# Altium schematic sheet DC_Link.SchDoc
size A4; SheetNumber: 8; SheetTotal: 9
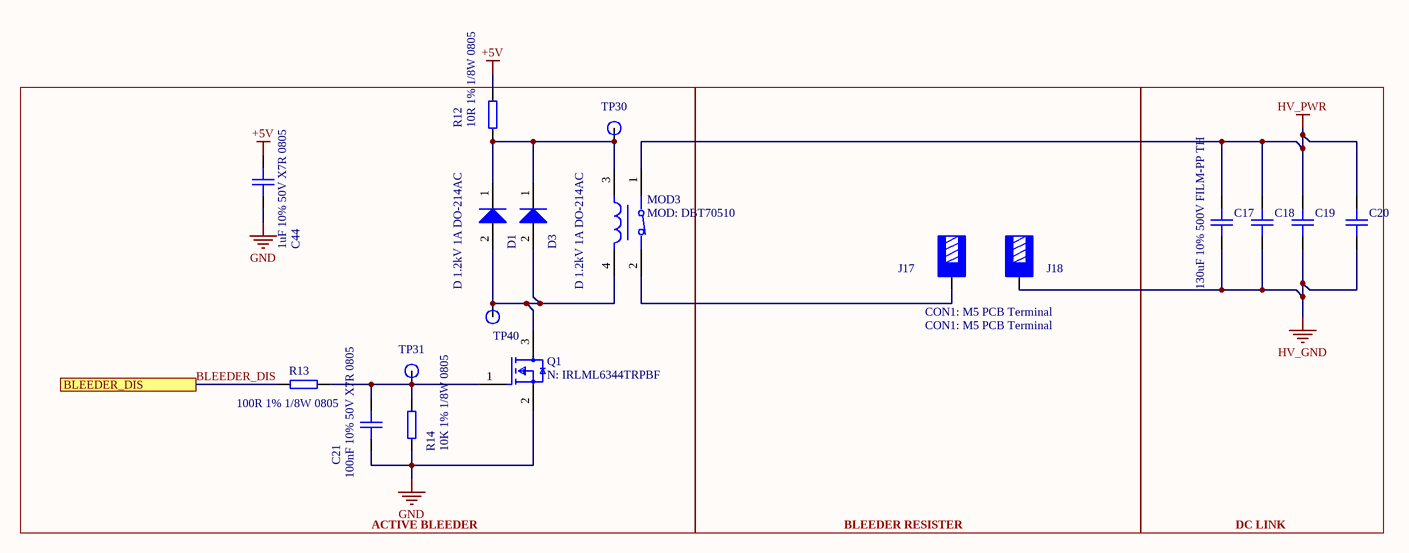
[diagram p0: DC_Link.SchDoc]

## Parts
C17  130uF 10% 500V FILM-PP TH  [New footprint 1]
C18  130uF 10% 500V FILM-PP TH  [New footprint 1]  (value not drawn)
C19  130uF 10% 500V FILM-PP TH  [New footprint 1]  (value not drawn)
C20  130uF 10% 500V FILM-PP TH  [New footprint 1]  (value not drawn)
C21  100nF 10% 50V X7R 0805  [CAPC2012X10N]
C44  1uF 10% 50V X7R 0805  [CAPC2012X10N]
D1  D 1.2kV 1A DO-214AC  [FP-95400-MFG]
D3  D 1.2kV 1A DO-214AC  [FP-95400-MFG]
J17  CON1: M5 PCB Terminal  [CON1: M5 PCB Terminal-Footprint-1]
J18  CON1: M5 PCB Terminal  [CON1: M5 PCB Terminal-Footprint-1]
MOD3  MOD: DBT70510  [FP-DBT70510-MFG]
Q1  N: IRLML6344TRPBF  [FP-SOT23-MFG]
R12  10R 1% 1/8W 0805  [RESC2012X05N]
R13  100R 1% 1/8W 0805  [RESC2012X05N]
R14  10K 1% 1/8W 0805  [RESC2012X05N]
TP30  TestPoint  [Test Point-Footprint-1]  (value not drawn)
TP31  TestPoint  [Test Point-Footprint-1]  (value not drawn)
TP40  TestPoint  [Test Point-Footprint-1]  (value not drawn)

## Blocks framed on the sheet
ACTIVE BLEEDER: C21 C44 D1 D3 MOD3 Q1 R12-R14 TP30 TP31 TP40
BLEEDER RESISTER: J17 J18
DC LINK: C17-C20

## Ports
BLEEDER_DIS (see Control_Board_SCH[4C], Microcontroller[4B])

## Nets
+5V: C44.2 R12.1
GND: C21.1 C44.1 Q1.2(S) R14.1
HV_GND: C17.1 C18.1 C19.1 C20.1 J18.1
HV_PWR: C17.2 C18.2 C19.2 C20.2 MOD3.1
BLEEDER_DIS: R13.1 ; port BLEEDER_DIS
NetC21_2: C21.2 Q1.1(G) R13.2 R14.2 TP31.1
NetD1_1: D1.1(K) D3.1(K) MOD3.3(-) R12.2 TP30.1
NetD1_2: D1.2(A) D3.2(A) MOD3.4(+) Q1.3(D) TP40.1
NetJ17_1: J17.1 MOD3.2

## Library data of the parts
C17-C20 = CMP-001-00089-1: 130 µF Film Capacitor 500V Polypropylene (PP), Metallized Radial - 4 Leads; Manufacturer: KEMET; Manufacturer Part Number: C4AQLBW6130A3NK; Capacitance: 130µF; Height: 50mm; Min Operating Temperature: -55°C; Contact Plating: Tin; Number of Terminals: 4; Max Operating Temperature: 105°C; Length: 57.5mm; Category: Film Capacitors; REACH SVHC: Yes; Harmonized Tariff Schedule (HTS) Code: 8532.25.00.80; Introduction Date: 2018-05-22; Lifecycle Status: Production; Voltage Rating (DC): 500V; Export Control Classification Number (ECCN) Code: EAR99; Dielectric Material: Polypropylene; RoHS: Compliant; Width: 35mm
C21 = CMP-001-00091-1: Multilayer Ceramic Capacitors MLCC - SMD/SMT 50V 0.1uF X7R 0805 10%; Manufacturer: Stackpole Electronics; Manufacturer Part Number: CML0805X7R104KT50V; Voltage Rating (DC): 50V; REACH SVHC: Yes; Height: 800µm; Min Operating Temperature: -55°C; Dielectric Material: Ceramic; RoHS: Compliant; Number of Terminals: 2; Lifecycle Status: Production; Width: 1.25mm; Length: 2mm; Category: Ceramic Capacitors; Max Operating Temperature: 125°C; Mount: Surface Mount; Capacitance: 100nF
C44 = CMP-001-00047-1: Ceramic Capacitor, Multilayer, Ceramic, 50V, 10% +Tol, 10% -Tol, X7R, 15% TC, 1uF, Surface Mount, 0805; Manufacturer Part Number: C2012X7R1H105K125AB; Manufacturer Lifecycle Status: PRODUCTION; Manufacturer: TDK; Value: 1µF; Export Control Classification Number (ECCN) Code: EAR99; Case/Package: 0805; Max Length: 3.5mm; ComponentLink4Description: https://datasheet.octopart.com:443/C3216X7R1H106K160AC-TDK-datasheet-151546523.pdf?src-supplier=ODG+(Origin+Data+Global); ComponentLink1URL: https://datasheet.octopart.com:443/C3216X7R1H106K160AC-TDK-datasheet-175423548.pdf?src-supplier=TME; Category: Ceramic Capacitors; Voltage Rating (DC): 50V; Case Code (Metric): 2012; Lifecycle Status: Production; Height: 1.6mm; Design Item ID: 1uF 10% 50V X7R 0805; Min Length: 3.1mm; Min Operating Temperature: -55°C; Pricing: 100=3,09, 250=2,81, 500=2,35, 1000=2,2, 2000=1,97 (DKK); Width: 1.6mm; Voltage Rating: 50V; Stock: 26276; ComponentLink2Description: https://datasheet.octopart.com:443/C3216X7R1H106K160AC-TDK-datasheet-182135025.pdf?src-supplier=TME; Harmonized Tariff Schedule (HTS) Code: 8532.24.00.20; ComponentLink3Description: https://datasheet.octopart.com:443/C3216X7R1H106K160AC-TDK-datasheet-159617022.pdf?src-supplier=TME; Thickness: 1.6mm; Max Operating Temperature: 125°C; ComponentLink4URL: https://datasheet.octopart.com:443/C3216X7R1H106K160AC-TDK-datasheet-151546523.pdf?src-supplier=ODG+(Origin+Data+Global); Lead Free: Lead Free; ComponentLink3URL: https://datasheet.octopart.com:443/C3216X7R1H106K160AC-TDK-datasheet-159617022.pdf?src-supplier=TME; ComponentLink1Description: https://datasheet.octopart.com:443/C3216X7R1H106K160AC-TDK-datasheet-175423548.pdf?src-supplier=TME; Max Width: 1.9mm; Dielectric: X7R; RoHS: Compliant; China RoHS: Compliant; REACH SVHC: Yes; ComponentLink2URL: https://datasheet.octopart.com:443/C3216X7R1H106K160AC-TDK-datasheet-182135025.pdf?src-supplier=TME; Length: 3.2mm; ComponentLink5URL: https://datasheet.octopart.com/C3216X7R1H106K160AC-TDK-datasheet-41194876.pdf; Introduction Date: 2018-03-29; Dielectric Material: Ceramic; Min Width: 1.5mm; Number of Terminals: 2; Material: Ceramic; Source: MasterLibrary_SCH.SchLib; Mounting Technology: Surface Mount; ComponentLink5Description: https://datasheet.octopart.com/C3216X7R1H106K160AC-TDK-datasheet-41194876.pdf
D1 D3 = CMP-001-00088-2: Rectifier Diode, 1 Phase, 1 Element, 1A, 1000V V(RRM), Silicon, DO-214AC; Manufacturer: Vishay; Manufacturer Part Number: US1M-E3/61T; Max Surge Current: 30A; Max Junction Temperature (Tj): 150°C; Value: 10pF; Voltage Rating (DC): 1kV; Number of Elements: 1; Reverse Recovery Time: 75ns; Polarity: Standard; Peak Reverse Current: 10µA; Element Configuration: Single; Forward Voltage: 1.7V; Min Operating Temperature: -55°C; Output Current: 1A; Schedule B: 8541100080, 8541100080; Lead Free: Lead Free; Reverse Voltage: 1kV; Current: 1A; Min Breakdown Voltage: 1kV; Termination: SMD/SMT; Case/Package: SMA; Lifecycle Status: Production; Voltage: 1kV; Length: 4.5mm; Height: 2.29mm; Pins: 2; Number of Terminals: 2; Current Rating: 1A; Width: 4.5mm; Reverse Standoff Voltage: 1kV; Packaging: Cut Tape; Forward Current: 1A; China RoHS: Non-Compliant; Max Reverse Voltage (DC): 1kV; Recovery Time: 75ns; Mounting Technology: Surface Mount; Max Forward Surge Current (Ifsm): 30A; Average Rectified Current: 1A; Max Operating Temperature: 150°C; RoHS: Compliant; Max Output current: 1A; Peak Non-Repetitive Surge Current: 30A; Max Repetitive Reverse Voltage (Vrrm): 1kV; REACH SVHC: No
J17 J18 = CMP-002-00581-1: Manufacturer: Lab; Manufacturer Part Number: M5 PCB Terminal
MOD3 = CMP-00250-1: Electromechanical Relay SPST-NC 2A 5VDC 38Ohm Through Hole; Manufacturer: Sensata /Cynergy3; Coil Current: 131.5mA; Number of Contacts: 1; Coil Voltage (DC): 5V; Coil Resistance: 38Ω; Coil Type: Non-Latching; Current Rating: 3A; Operate Time: 2ms; Number of Terminals: 4; Height: 18.5mm; Min Operating Temperature: -20°C; Max Operating Temperature: 70°C; Depth: 15.8mm; Contact Current Rating: 2A; Manufacturer Part Number: DBT70510; Length: 60mm; Mount: Through Hole; Category: Signal Relays
Q1 = CMP-013-00010-1: N-Channel 30 V 5A (Ta) 1.3W (Ta) Surface Mount Micro3™/SOT-23; Manufacturer: Infineon; Manufacturer Package Identifier: Micro3; Gate to Source Voltage (Vgs): 12V; Drain to Source Voltage (Vdss): 30V; Drain to Source Resistance: 29mΩ; Input Capacitance: 650pF; Fall Time: 9.1ns; Element Configuration: Single; Continuous Drain Current (ID): 5A; Lead Free: Lead Free; Height: 1.12mm; Lifecycle Status: Production; Case/Package: SOT-23; Introduction Date: 2010-10-28; Export Control Classification Number (ECCN) Code: EAR99; Drain to Source Breakdown Voltage: 30V; Category: MOSFETs; Manufacturer Part Number: IRLML6344TRPBF; Country of Origin: Mainland China, UK; Length: 3.04mm; Harmonized Tariff Schedule (HTS) Code: 8541.29.00.95
R12 = CMP-009-00662-1: Res Thick Film 0805 10 Ohm 1% 0.125W ±100ppm/°C Molded SMD Paper T/R; Manufacturer Part Number: RMCF0805FT10R0; Manufacturer: Stackpole Electronics; Working Voltage: 150V; Power Rating: 125mW; Value: 10; Features: Automotive AEC-Q200; Lifecycle Status: Production; ComponentLink10URL: https://datasheet.octopart.com:443/RMCF0805FT10K0-Stackpole-Electronics-datasheet-11547379.pdf?src-supplier=Future+Electronics; Case Code (Metric): 2012; ComponentLink16URL: http://sigma.octopart.com:80/141158211/reach_statement/Stackpole-Electronics-RMCF0805FT10K0.pdf?src-supplier=Compliance+Statements; ComponentLink14URL: https://datasheet.octopart.com:443/RMCF0805FT10K0-Stackpole-Electronics-datasheet-5313682.pdf?src-supplier=Future+Electronics; ComponentLink6URL: https://datasheet.octopart.com:443/RMCF0805FT10K0-Stackpole-Electronics-datasheet-62091608.pdf?src-supplier=Stackpole+Electronics; ComponentLink3URL: https://datasheet.octopart.com:443/RMCF0805FT10K0-Stackpole-Electronics-datasheet-28504820.pdf?src-supplier=Upverter; Design Item ID: 10R 1% 1/8W 0805; Mounting Technology: Surface Mount; ComponentLink9URL: https://datasheet.octopart.com:443/RMCF0805FT10K0-Stackpole-Electronics-datasheet-11546843.pdf?src-supplier=Arrow+Electronics; ComponentLink2Description: https://datasheet.octopart.com:443/RMCF0805FT10K0-Stackpole-Electronics-datasheet-12534581.pdf?src-supplier=Upverter; Voltage Rating: 150V; ComponentLink17Description: http://sigma.octopart.com:80/141158212/rohs_statement/Stackpole-Electronics-RMCF0805FT10K0.pdf?src-supplier=Compliance+Statements; Stock: 3420000; Number of Terminations: 2; Contact Plating: Tin; ComponentLink1Description: https://datasheet.octopart.com:443/RMCF0805FT10K0-Stackpole-Electronics-datasheet-182148065.pdf?src-supplier=IHS; ComponentLink2URL: https://datasheet.octopart.com:443/RMCF0805FT10K0-Stackpole-Electronics-datasheet-12534581.pdf?src-supplier=Upverter; Source: MasterLibrary_SCH.SchLib; Length: 2mm; ComponentLink13Description: https://datasheet.octopart.com:443/RMCF0805FT10K0-Stackpole-Electronics-datasheet-8088878.pdf?src-supplier=Future+Electronics; Lead Free: Lead Free; Category: Chip SMD Resistors; Composition: Thick Film; Tolerance: 1%; Schedule B: 8533210045, 8533210045; RoHS: Compliant; ComponentLink15URL: http://sigma.octopart.com:80/15940719/materials_sheet/Stackpole-Electronics-RMCF0805FT10K0.pdf?src-supplier=Compliance+Statements; Case/Package: 0805; Pricing: 5000=0.00245, 10000=0.00241, 20000=0.00238, 40000=0.00234, 80000=0.0023 (USD); ComponentLink8Description: https://datasheet.octopart.com:443/RMCF0805FT10K0-Stackpole-Electronics-datasheet-154799224.pdf?src-supplier=Master+Electronics; ComponentLink11Description: https://datasheet.octopart.com:443/RMCF0805FT10K0-Stackpole-Electronics-datasheet-8359789.pdf?src-supplier=Future+Electronics; China RoHS: Non-Compliant; Height: 500µm; ComponentLink9Description: https://datasheet.octopart.com:443/RMCF0805FT10K0-Stackpole-Electronics-datasheet-11546843.pdf?src-supplier=Arrow+Electronics; ComponentLink8URL: https://datasheet.octopart.com:443/RMCF0805FT10K0-Stackpole-Electronics-datasheet-154799224.pdf?src-supplier=Master+Electronics; ComponentLink12Description: https://datasheet.octopart.com:443/RMCF0805FT10K0-Stackpole-Electronics-datasheet-8324226.pdf?src-supplier=Future+Electronics; Temperature Coefficient: 100ppm/°C; ComponentLink12URL: https://datasheet.octopart.com:443/RMCF0805FT10K0-Stackpole-Electronics-datasheet-8324226.pdf?src-supplier=Future+Electronics; Number of Terminals: 2; Depth: 1.25mm; ComponentLink7Description: https://datasheet.octopart.com:443/RMCF0805FT10K0-Stackpole-Electronics-datasheet-10788263.pdf?src-supplier=Stackpole+Electronics; ComponentLink15Description: http://sigma.octopart.com:80/15940719/materials_sheet/Stackpole-Electronics-RMCF0805FT10K0.pdf?src-supplier=Compliance+Statements; ComponentLink6Description: https://datasheet.octopart.com:443/RMCF0805FT10K0-Stackpole-Electronics-datasheet-62091608.pdf?src-supplier=Stackpole+Electronics; Packaging: Cut Tape (CT); Max Operating Temperature: 155°C; ComponentLink7URL: https://datasheet.octopart.com:443/RMCF0805FT10K0-Stackpole-Electronics-datasheet-10788263.pdf?src-supplier=Stackpole+Electronics; ComponentLink16Description: http://sigma.octopart.com:80/141158211/reach_statement/Stackpole-Electronics-RMCF0805FT10K0.pdf?src-supplier=Compliance+Statements; Width: 1.25mm; Power Dissipation: 125mW; ComponentLink5Description: https://datasheet.octopart.com:443/RMCF0805FT10K0-Stackpole-Electronics-datasheet-141193804.pdf?src-supplier=Stackpole+Electronics; Radiation Hardening: No; Military Standard: Not; Min Operating Temperature: -55°C; ComponentLink11URL: https://datasheet.octopart.com:443/RMCF0805FT10K0-Stackpole-Electronics-datasheet-8359789.pdf?src-supplier=Future+Electronics; ComponentLink3Description: https://datasheet.octopart.com:443/RMCF0805FT10K0-Stackpole-Electronics-datasheet-28504820.pdf?src-supplier=Upverter; REACH SVHC: Yes; ComponentLink4Description: https://datasheet.octopart.com:443/RMCF0805FT10K0-Stackpole-Electronics-datasheet-12510902.pdf?src-supplier=Upverter; ComponentLink10Description: https://datasheet.octopart.com:443/RMCF0805FT10K0-Stackpole-Electronics-datasheet-11547379.pdf?src-supplier=Future+Electronics; ComponentLink5URL: https://datasheet.octopart.com:443/RMCF0805FT10K0-Stackpole-Electronics-datasheet-141193804.pdf?src-supplier=Stackpole+Electronics; Max Power Dissipation: 125mW; ComponentLink13URL: https://datasheet.octopart.com:443/RMCF0805FT10K0-Stackpole-Electronics-datasheet-8088878.pdf?src-supplier=Future+Electronics; ComponentLink17URL: http://sigma.octopart.com:80/141158212/rohs_statement/Stackpole-Electronics-RMCF0805FT10K0.pdf?src-supplier=Compliance+Statements; ComponentLink14Description: https://datasheet.octopart.com:443/RMCF0805FT10K0-Stackpole-Electronics-datasheet-5313682.pdf?src-supplier=Future+Electronics; ComponentLink4URL: https://datasheet.octopart.com:443/RMCF0805FT10K0-Stackpole-Electronics-datasheet-12510902.pdf?src-supplier=Upverter; ComponentLink1URL: https://datasheet.octopart.com:443/RMCF0805FT10K0-Stackpole-Electronics-datasheet-182148065.pdf?src-supplier=IHS
R13 = CMP-009-00668-1: Res Thick Film 0805 100 Ohm 1% 0.125W ±100ppm/°C Molded SMD Paper T/R; Manufacturer Part Number: RMCF0805FT100R; Manufacturer: Stackpole Electronics; Working Voltage: 150V; Power Rating: 125mW; Value: 100; Features: Automotive AEC-Q200; Lifecycle Status: Production; ComponentLink10URL: https://datasheet.octopart.com:443/RMCF0805FT10K0-Stackpole-Electronics-datasheet-11547379.pdf?src-supplier=Future+Electronics; Case Code (Metric): 2012; ComponentLink16URL: http://sigma.octopart.com:80/141158211/reach_statement/Stackpole-Electronics-RMCF0805FT10K0.pdf?src-supplier=Compliance+Statements; ComponentLink14URL: https://datasheet.octopart.com:443/RMCF0805FT10K0-Stackpole-Electronics-datasheet-5313682.pdf?src-supplier=Future+Electronics; ComponentLink6URL: https://datasheet.octopart.com:443/RMCF0805FT10K0-Stackpole-Electronics-datasheet-62091608.pdf?src-supplier=Stackpole+Electronics; ComponentLink3URL: https://datasheet.octopart.com:443/RMCF0805FT10K0-Stackpole-Electronics-datasheet-28504820.pdf?src-supplier=Upverter; Design Item ID: 100R 1% 1/8W 0805; Mounting Technology: Surface Mount; ComponentLink9URL: https://datasheet.octopart.com:443/RMCF0805FT10K0-Stackpole-Electronics-datasheet-11546843.pdf?src-supplier=Arrow+Electronics; ComponentLink2Description: https://datasheet.octopart.com:443/RMCF0805FT10K0-Stackpole-Electronics-datasheet-12534581.pdf?src-supplier=Upverter; Voltage Rating: 150V; ComponentLink17Description: http://sigma.octopart.com:80/141158212/rohs_statement/Stackpole-Electronics-RMCF0805FT10K0.pdf?src-supplier=Compliance+Statements; Stock: 3420000; Number of Terminations: 2; Contact Plating: Tin; ComponentLink1Description: https://datasheet.octopart.com:443/RMCF0805FT10K0-Stackpole-Electronics-datasheet-182148065.pdf?src-supplier=IHS; ComponentLink2URL: https://datasheet.octopart.com:443/RMCF0805FT10K0-Stackpole-Electronics-datasheet-12534581.pdf?src-supplier=Upverter; Source: MasterLibrary_SCH.SchLib; Length: 2mm; ComponentLink13Description: https://datasheet.octopart.com:443/RMCF0805FT10K0-Stackpole-Electronics-datasheet-8088878.pdf?src-supplier=Future+Electronics; Lead Free: Lead Free; Category: Chip SMD Resistors; Composition: Thick Film; Tolerance: 1%; Schedule B: 8533210045, 8533210045; RoHS: Compliant; ComponentLink15URL: http://sigma.octopart.com:80/15940719/materials_sheet/Stackpole-Electronics-RMCF0805FT10K0.pdf?src-supplier=Compliance+Statements; Case/Package: 0805; Pricing: 5000=0.00245, 10000=0.00241, 20000=0.00238, 40000=0.00234, 80000=0.0023 (USD); ComponentLink8Description: https://datasheet.octopart.com:443/RMCF0805FT10K0-Stackpole-Electronics-datasheet-154799224.pdf?src-supplier=Master+Electronics; ComponentLink11Description: https://datasheet.octopart.com:443/RMCF0805FT10K0-Stackpole-Electronics-datasheet-8359789.pdf?src-supplier=Future+Electronics; China RoHS: Non-Compliant; Height: 500µm; ComponentLink9Description: https://datasheet.octopart.com:443/RMCF0805FT10K0-Stackpole-Electronics-datasheet-11546843.pdf?src-supplier=Arrow+Electronics; ComponentLink8URL: https://datasheet.octopart.com:443/RMCF0805FT10K0-Stackpole-Electronics-datasheet-154799224.pdf?src-supplier=Master+Electronics; ComponentLink12Description: https://datasheet.octopart.com:443/RMCF0805FT10K0-Stackpole-Electronics-datasheet-8324226.pdf?src-supplier=Future+Electronics; Temperature Coefficient: 100ppm/°C; ComponentLink12URL: https://datasheet.octopart.com:443/RMCF0805FT10K0-Stackpole-Electronics-datasheet-8324226.pdf?src-supplier=Future+Electronics; Number of Terminals: 2; Depth: 1.25mm; ComponentLink7Description: https://datasheet.octopart.com:443/RMCF0805FT10K0-Stackpole-Electronics-datasheet-10788263.pdf?src-supplier=Stackpole+Electronics; ComponentLink15Description: http://sigma.octopart.com:80/15940719/materials_sheet/Stackpole-Electronics-RMCF0805FT10K0.pdf?src-supplier=Compliance+Statements; ComponentLink6Description: https://datasheet.octopart.com:443/RMCF0805FT10K0-Stackpole-Electronics-datasheet-62091608.pdf?src-supplier=Stackpole+Electronics; Packaging: Cut Tape (CT); Max Operating Temperature: 155°C; ComponentLink7URL: https://datasheet.octopart.com:443/RMCF0805FT10K0-Stackpole-Electronics-datasheet-10788263.pdf?src-supplier=Stackpole+Electronics; ComponentLink16Description: http://sigma.octopart.com:80/141158211/reach_statement/Stackpole-Electronics-RMCF0805FT10K0.pdf?src-supplier=Compliance+Statements; Width: 1.25mm; Power Dissipation: 125mW; ComponentLink5Description: https://datasheet.octopart.com:443/RMCF0805FT10K0-Stackpole-Electronics-datasheet-141193804.pdf?src-supplier=Stackpole+Electronics; Radiation Hardening: No; Military Standard: Not; Min Operating Temperature: -55°C; ComponentLink11URL: https://datasheet.octopart.com:443/RMCF0805FT10K0-Stackpole-Electronics-datasheet-8359789.pdf?src-supplier=Future+Electronics; ComponentLink3Description: https://datasheet.octopart.com:443/RMCF0805FT10K0-Stackpole-Electronics-datasheet-28504820.pdf?src-supplier=Upverter; REACH SVHC: Yes; ComponentLink4Description: https://datasheet.octopart.com:443/RMCF0805FT10K0-Stackpole-Electronics-datasheet-12510902.pdf?src-supplier=Upverter; ComponentLink10Description: https://datasheet.octopart.com:443/RMCF0805FT10K0-Stackpole-Electronics-datasheet-11547379.pdf?src-supplier=Future+Electronics; ComponentLink5URL: https://datasheet.octopart.com:443/RMCF0805FT10K0-Stackpole-Electronics-datasheet-141193804.pdf?src-supplier=Stackpole+Electronics; Max Power Dissipation: 125mW; ComponentLink13URL: https://datasheet.octopart.com:443/RMCF0805FT10K0-Stackpole-Electronics-datasheet-8088878.pdf?src-supplier=Future+Electronics; ComponentLink17URL: http://sigma.octopart.com:80/141158212/rohs_statement/Stackpole-Electronics-RMCF0805FT10K0.pdf?src-supplier=Compliance+Statements; ComponentLink14Description: https://datasheet.octopart.com:443/RMCF0805FT10K0-Stackpole-Electronics-datasheet-5313682.pdf?src-supplier=Future+Electronics; ComponentLink4URL: https://datasheet.octopart.com:443/RMCF0805FT10K0-Stackpole-Electronics-datasheet-12510902.pdf?src-supplier=Upverter; ComponentLink1URL: https://datasheet.octopart.com:443/RMCF0805FT10K0-Stackpole-Electronics-datasheet-182148065.pdf?src-supplier=IHS
R14 = CMP-009-00659-2: Res Thick Film 0805 10K Ohm 1% 0.125W ±100ppm/°C Molded SMD Paper T/R; Manufacturer Part Number: RMCF0805FT10K0; Manufacturer: Stackpole Electronics; Power Rating: 125mW; Working Voltage: 150V; ComponentLink17Description: http://sigma.octopart.com:80/141158212/rohs_statement/Stackpole-Electronics-RMCF0805FT10K0.pdf?src-supplier=Compliance+Statements; Military Standard: Not; ComponentLink2Description: https://datasheet.octopart.com:443/RMCF0805FT10K0-Stackpole-Electronics-datasheet-12534581.pdf?src-supplier=Upverter; Power Dissipation: 125mW; Radiation Hardening: No; Min Operating Temperature: -55°C; Mounting Technology: Surface Mount; Pricing: 5000=0.00245, 10000=0.00241, 20000=0.00238, 40000=0.00234, 80000=0.0023 (USD); ComponentLink9Description: https://datasheet.octopart.com:443/RMCF0805FT10K0-Stackpole-Electronics-datasheet-11546843.pdf?src-supplier=Arrow+Electronics; Temperature Coefficient: 100ppm/°C; Contact Plating: Tin; Number of Terminals: 2; Source: MasterLibrary_SCH.SchLib; ComponentLink16URL: http://sigma.octopart.com:80/141158211/reach_statement/Stackpole-Electronics-RMCF0805FT10K0.pdf?src-supplier=Compliance+Statements; ComponentLink10Description: https://datasheet.octopart.com:443/RMCF0805FT10K0-Stackpole-Electronics-datasheet-11547379.pdf?src-supplier=Future+Electronics; Case/Package: 0805; RoHS: Compliant; ComponentLink14Description: https://datasheet.octopart.com:443/RMCF0805FT10K0-Stackpole-Electronics-datasheet-5313682.pdf?src-supplier=Future+Electronics; Max Power Dissipation: 125mW; ComponentLink7URL: https://datasheet.octopart.com:443/RMCF0805FT10K0-Stackpole-Electronics-datasheet-10788263.pdf?src-supplier=Stackpole+Electronics; Number of Terminations: 2; Tolerance: 1%; Stock: 3420000; ComponentLink3Description: https://datasheet.octopart.com:443/RMCF0805FT10K0-Stackpole-Electronics-datasheet-28504820.pdf?src-supplier=Upverter; REACH SVHC: Yes; ComponentLink7Description: https://datasheet.octopart.com:443/RMCF0805FT10K0-Stackpole-Electronics-datasheet-10788263.pdf?src-supplier=Stackpole+Electronics; ComponentLink4URL: https://datasheet.octopart.com:443/RMCF0805FT10K0-Stackpole-Electronics-datasheet-12510902.pdf?src-supplier=Upverter; Max Operating Temperature: 155°C; Voltage Rating: 150V; ComponentLink9URL: https://datasheet.octopart.com:443/RMCF0805FT10K0-Stackpole-Electronics-datasheet-11546843.pdf?src-supplier=Arrow+Electronics; ComponentLink5URL: https://datasheet.octopart.com:443/RMCF0805FT10K0-Stackpole-Electronics-datasheet-141193804.pdf?src-supplier=Stackpole+Electronics; ComponentLink12URL: https://datasheet.octopart.com:443/RMCF0805FT10K0-Stackpole-Electronics-datasheet-8324226.pdf?src-supplier=Future+Electronics; ComponentLink4Description: https://datasheet.octopart.com:443/RMCF0805FT10K0-Stackpole-Electronics-datasheet-12510902.pdf?src-supplier=Upverter; ComponentLink14URL: https://datasheet.octopart.com:443/RMCF0805FT10K0-Stackpole-Electronics-datasheet-5313682.pdf?src-supplier=Future+Electronics; ComponentLink15URL: http://sigma.octopart.com:80/15940719/materials_sheet/Stackpole-Electronics-RMCF0805FT10K0.pdf?src-supplier=Compliance+Statements; Category: Chip SMD Resistors; Value: 10k; ComponentLink2URL: https://datasheet.octopart.com:443/RMCF0805FT10K0-Stackpole-Electronics-datasheet-12534581.pdf?src-supplier=Upverter; Packaging: Cut Tape (CT); ComponentLink8Description: https://datasheet.octopart.com:443/RMCF0805FT10K0-Stackpole-Electronics-datasheet-154799224.pdf?src-supplier=Master+Electronics; Composition: Thick Film; Height: 500µm; ComponentLink17URL: http://sigma.octopart.com:80/141158212/rohs_statement/Stackpole-Electronics-RMCF0805FT10K0.pdf?src-supplier=Compliance+Statements; ComponentLink6Description: https://datasheet.octopart.com:443/RMCF0805FT10K0-Stackpole-Electronics-datasheet-62091608.pdf?src-supplier=Stackpole+Electronics; ComponentLink11Description: https://datasheet.octopart.com:443/RMCF0805FT10K0-Stackpole-Electronics-datasheet-8359789.pdf?src-supplier=Future+Electronics; ComponentLink10URL: https://datasheet.octopart.com:443/RMCF0805FT10K0-Stackpole-Electronics-datasheet-11547379.pdf?src-supplier=Future+Electronics; ComponentLink1URL: https://datasheet.octopart.com:443/RMCF0805FT10K0-Stackpole-Electronics-datasheet-182148065.pdf?src-supplier=IHS; Features: Automotive AEC-Q200; Width: 1.25mm; ComponentLink13Description: https://datasheet.octopart.com:443/RMCF0805FT10K0-Stackpole-Electronics-datasheet-8088878.pdf?src-supplier=Future+Electronics; ComponentLink12Description: https://datasheet.octopart.com:443/RMCF0805FT10K0-Stackpole-Electronics-datasheet-8324226.pdf?src-supplier=Future+Electronics; ComponentLink3URL: https://datasheet.octopart.com:443/RMCF0805FT10K0-Stackpole-Electronics-datasheet-28504820.pdf?src-supplier=Upverter; ComponentLink8URL: https://datasheet.octopart.com:443/RMCF0805FT10K0-Stackpole-Electronics-datasheet-154799224.pdf?src-supplier=Master+Electronics; ComponentLink13URL: https://datasheet.octopart.com:443/RMCF0805FT10K0-Stackpole-Electronics-datasheet-8088878.pdf?src-supplier=Future+Electronics; Lifecycle Status: Production; China RoHS: Non-Compliant; Schedule B: 8533210045, 8533210045; Lead Free: Lead Free; ComponentLink6URL: https://datasheet.octopart.com:443/RMCF0805FT10K0-Stackpole-Electronics-datasheet-62091608.pdf?src-supplier=Stackpole+Electronics; ComponentLink5Description: https://datasheet.octopart.com:443/RMCF0805FT10K0-Stackpole-Electronics-datasheet-141193804.pdf?src-supplier=Stackpole+Electronics; Case Code (Metric): 2012; ComponentLink15Description: http://sigma.octopart.com:80/15940719/materials_sheet/Stackpole-Electronics-RMCF0805FT10K0.pdf?src-supplier=Compliance+Statements; Depth: 1.25mm; ComponentLink11URL: https://datasheet.octopart.com:443/RMCF0805FT10K0-Stackpole-Electronics-datasheet-8359789.pdf?src-supplier=Future+Electronics; ComponentLink1Description: https://datasheet.octopart.com:443/RMCF0805FT10K0-Stackpole-Electronics-datasheet-182148065.pdf?src-supplier=IHS; Length: 2mm; Design Item ID: 10K 1% 1/4W 0805; ComponentLink16Description: http://sigma.octopart.com:80/141158211/reach_statement/Stackpole-Electronics-RMCF0805FT10K0.pdf?src-supplier=Compliance+Statements
TP30 TP31 TP40 = CMP-002-00584-1